# Altium project Emergency_Isolator.PrjPCB
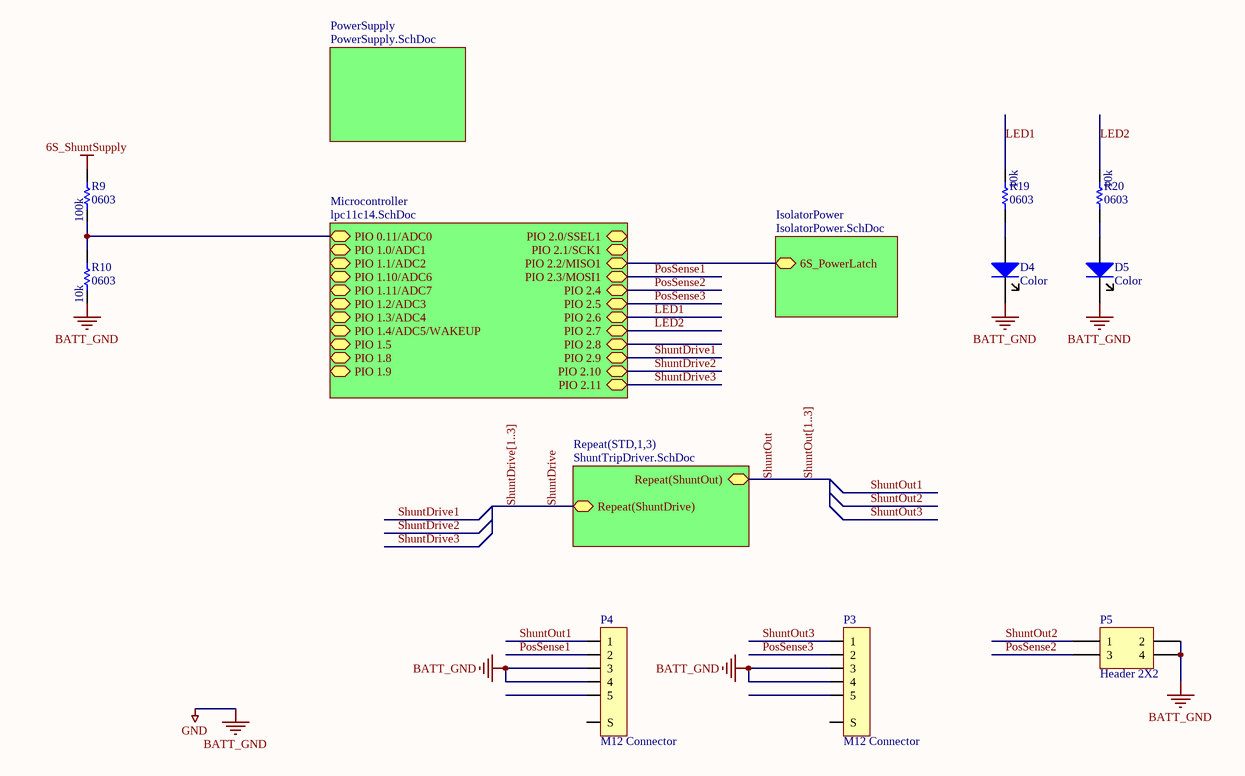
[diagram p0: IsolatorTop.SchDoc]
5 sheets, 75 parts. Net scope: hierarchical (ports join the sheet entries above them; power ports are global).
Board file: EmergencyIsolator.PcbDoc
Sheets:
  IsolatorTop.SchDoc
    IsolatorPower = IsolatorPower.SchDoc
    STD1 = ShuntTripDriver.SchDoc
    STD2 = ShuntTripDriver.SchDoc
    STD3 = ShuntTripDriver.SchDoc
    Microcontroller = lpc11c14.SchDoc
    PowerSupply = PowerSupply.SchDoc

## Sheet IsolatorTop.SchDoc
size A4

### Parts
D4  value Color  [CAP_0.1_POL]  (hidden comment: LED)
D5  value Color  [CAP_0.1_POL]  (hidden comment: LED)
P3  M12 Connector  [M12_5P_VERT]
P4  M12 Connector  [M12_5P_VERT]
P5  Header 2X2  [HDR2X2]
R9  value 100k  package: 0603  [0603_M]  (hidden comment: R)
R10  value 10k  package: 0603  [0603_M]  (hidden comment: R)
R19  value 10k  package: 0603  [0603_M]  (hidden comment: R)
R20  value 10k  package: 0603  [0603_M]  (hidden comment: R)

### Sub-sheets
IsolatorPower = IsolatorPower.SchDoc: 6S_PowerLatch
Microcontroller = lpc11c14.SchDoc: PIO 1.0/ADC1, PIO 1.1/ADC2, PIO 1.10/ADC6, PIO 1.11/ADC7, PIO 1.2/ADC3, PIO 1.3/ADC4, PIO 1.4/ADC5/WAKEUP, PIO 1.5, PIO 1.8, PIO 1.9, PIO 0.11/ADC0, PIO 2.6, PIO 2.0/SSEL1, PIO 2.7, PIO 2.3/MOSI1, PIO 2.8, PIO 2.1/SCK1, PIO 2.4, PIO 2.11, PIO 2.5, PIO 2.2/MISO1, PIO 2.9, PIO 2.10
PowerSupply = PowerSupply.SchDoc: no entries
Repeat(STD,1,3) = ShuntTripDriver.SchDoc: Repeat(ShuntOut), Repeat(ShuntDrive)

### Nets
6S_ShuntSupply: R9.1
BATT_GND: D4.2(K) D5.2(K) P3.3 P3.4 P4.3 P4.4 P5.2 P5.4 R10.2  [also labelled GND]
6S_PowerLatch: sheet IsolatorPower/6S_PowerLatch, sheet Microcontroller/PIO 2.2/MISO1
LED1: R19.2 ; sheet Microcontroller/PIO 2.6
LED2: R20.2 ; sheet Microcontroller/PIO 2.7
PIO 0.11/ADC0: R9.2 R10.1 ; sheet Microcontroller/PIO 0.11/ADC0
PosSense1: P4.2 ; sheet Microcontroller/PIO 2.3/MOSI1  [project net PIO 2.3/MOSI1]
PosSense2: P5.3 ; sheet Microcontroller/PIO 2.4  [project net PIO 2.4]
PosSense3: P3.2 ; sheet Microcontroller/PIO 2.5  [project net PIO 2.5]
ShuntDrive: sheet Repeat(STD,1,3)/Repeat(ShuntDrive)
ShuntOut: sheet Repeat(STD,1,3)/Repeat(ShuntOut)
ShuntOut1: P4.1
ShuntOut2: P5.1
ShuntOut3: P3.1
NetD4_1: D4.1(A) R19.1
NetD5_1: D5.1(A) R20.1

Not connected (* = marked no-connect by the designer): P3 5 S; P4 5 S

### Buses and harness runs
bus ShuntDrive[1..3]
bus ShuntOut[1..3]

### Library data of the parts
D4 D5 = D LED: Supplier 1: Digi-Key
P3 P4 = M12 Connector: 5 Pin
P5 = Header 2X2: Header, 2-Pin, Dual row; LatestRevisionDate: 17-Jul-2002; LatestRevisionNote: Re-released for DXP Platform.; Publisher: Altium Limited
R9 R10 R19 R20 = R: Resistor; Supplier 1: Digikey

## Sheet IsolatorPower.SchDoc
size A4
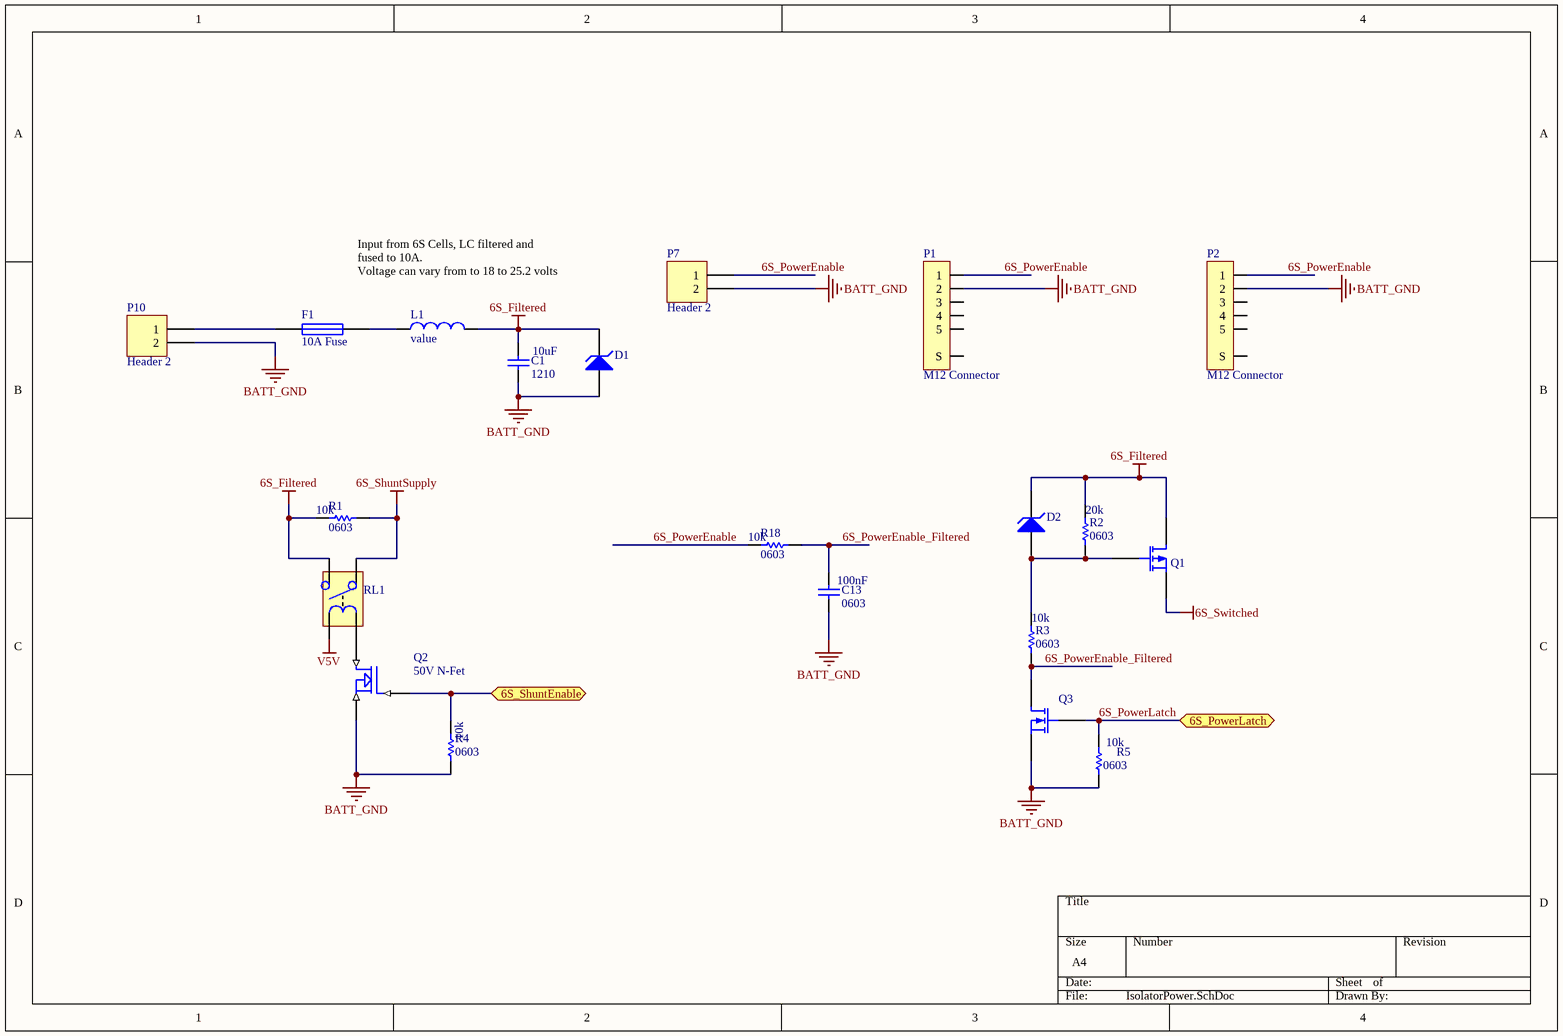
[diagram p1: IsolatorPower.SchDoc]

### Parts
C1  value 10uF  package: 1210  [1210_M]  (hidden comment: C)
C13  value 100nF  package: 0603  [0603_M]  (hidden comment: C)
D1  (no value)  [0805_M_POL]
D2  (no value)  [0805_M_POL]
F1  10A Fuse  [LITTELFUSE-154]
L1  value  [0805_M]
P1  M12 Connector  [M12_5P_VERT]
P2  M12 Connector  [M12_5P_VERT]
P7  Header 2  [HDR1X2]
P10  Header 2  [HDR1X2]
Q1  PFET 40V 10A  [TO-252 (D-Pak)]  (value not drawn)
Q2  50V N-Fet  [SOT23-3]
Q3  NFET 30V 5A  [SOT23-3]  (value not drawn)
R1  value 10k  package: 0603  [0603_M]  (hidden comment: R)
R2  value 20k  package: 0603  [0603_M]  (hidden comment: R)
R3  value 10k  package: 0603  [0603_M]  (hidden comment: R)
R4  value 10k  package: 0603  [0603_M]  (hidden comment: R)
R5  value 10k  package: 0603  [0603_M]  (hidden comment: R)
R18  value 10k  package: 0603  [0603_M]  (hidden comment: R)
RL1  Relay  [RELAY_G5Q_4PIN]  (value not drawn)

### Ports
6S_PowerLatch, 6S_ShuntEnable

### Nets
6S_Filtered: C1.1 D1.2(K) D2.2(K) L1.2(B) Q1.1(D) R1.2 R2.2 RL1.2
6S_ShuntSupply: R1.1 RL1.3
6S_Switched: Q1.3(S)
BATT_GND: C1.2 C13.2 D1.1(A) P1.2 P2.2 P7.2 P10.2 Q2.2(S) Q3.2(S) R4.1 R5.1
V5V: RL1.1
6S_PowerEnable: P1.1 P2.1 P7.1 R18.2
6S_PowerEnable_Filtered: C13.1 Q3.3(D) R3.1 R18.1
6S_PowerLatch: Q3.1(G) R5.2 ; port 6S_PowerLatch
NetD2_1: D2.1(A) Q1.2(G) R2.1 R3.2
NetF1_1: F1.1 P10.1
NetF1_2: F1.2 L1.1(A)
NetQ2_1: Q2.1(G) R4.2 ; port 6S_ShuntEnable
NetQ2_3: Q2.3(D) RL1.5

Not connected (* = marked no-connect by the designer): P1 3 4 5 S; P2 3 4 5 S

### Notes on the sheet
- Input from 6S Cells, LC filtered and fused to 10A.
  Voltage can vary from to 18 to 25.2 volts

### Library data of the parts
C1 C13 = C: Default Capacitor; Supplier: Digikey
D1 D2 = D Zener: Zener Diode; Supplier 1: Digikey
F1 = FUSE
L1 = L: Inductor
P1 P2 = M12 Connector: 5 Pin
P7 P10 = Header 2: Header, 2-Pin; LatestRevisionDate: 17-Jul-2002; LatestRevisionNote: Re-released for DXP Platform.; Publisher: Altium Limited
Q1 = PFET 40V 10A: 10A 40V; Supplier 1: Digi-Key; Supplier Part Number 1: 497-2456-1-ND
Q2 = ZXM61N02F: 1.7A, 20V N-Channel Enhancement mode FET
R1-R5 R18 = R: Resistor; Supplier 1: Digikey
RL1 = Relay: 10A 30VDC Max Normally Open; Manufacturer: Omron Electronics Inc-EMC Div; Manufacturer Part Number: G5Q-1A4 DC5; Description: RELAY GEN PURPOSE SPST 10A 5V; Relay Type: General Purpose; Coil Type: Non Latching; Coil Current: 40mA; Coil Voltage: 5VDC; Contact Form: SPST-NO (1 Form A); Switching Voltage: 277VAC, 30VDC - Max; Turn On Voltage (Max): 3.75 VDC; Turn Off Voltage (Min): 0.25 VDC; Operate Time: 10ms; Release Time: 5ms; Coil Power: 200 mW; Coil Resistance: 125 Ohms; Supplier 1: Digi-Key; RoHS: RoHS Compliant; Category: Relays; Stock 1: 6697; Pricing 1: 1=3.69, 10=3.459, 25=3.0752, 50=2.9214, 100=2.7676, 250=2.46012, 500=2.30634, 1000=2.15258, 2500=2.11414 (AUD); Packaging: Bulk; Contact Rating (Current): 10A; Features: Insulation - Class F, Sealed - Fully; Mounting Type: Through Hole; Termination Style: PC Pin; Contact Material: Silver Alloy; Operating Temperature: -40°C ~ 105°C; ComponentLink1URL: http://components.omron.com/components/web/PDFLIB.nsf/0/390BE1B2058B30BF85257201007DD57C/$file/G5Q_0911.pdf; ComponentLink1Description: http://components.omron.com/components/web/PDFLIB.nsf/0/390BE1B2058B30BF85257201007DD57C/$file/G5Q_0911.pdf; Supplier Part Number 1: Z3632-ND
Q3 = NFET 30V 5A: Supplier 1: Digi-Key; Supplier Part Number 1: IRLML6344TRPBFCT-ND

## Sheet ShuntTripDriver.SchDoc
size A4
Used 3 times, as channels STD1, STD2, STD3. Parts and nets are listed once, with the designators drawn on the sheet.
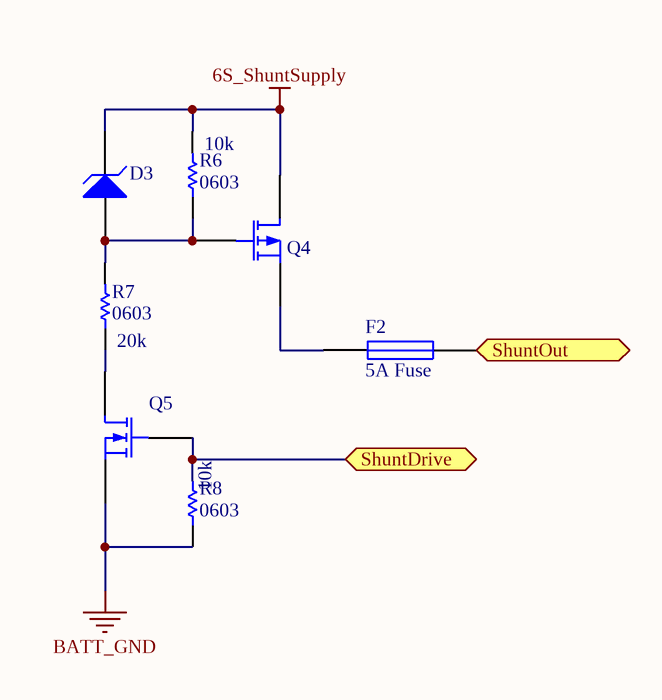
[diagram p2: ShuntTripDriver.SchDoc]

### Parts
D3  (no value)  [0805_M_POL]
F2  5A Fuse  [LITTELFUSE-154]
Q4  PFET 40V 10A  [TO-252 (D-Pak)]  (value not drawn)
Q5  NFET 30V 5A  [SOT23-3]  (value not drawn)
R6  value 10k  package: 0603  [0603_M]  (hidden comment: R)
R7  value 20k  package: 0603  [0603_M]  (hidden comment: R)
R8  value 10k  package: 0603  [0603_M]  (hidden comment: R)

### Ports
ShuntDrive, ShuntOut

### Nets
6S_ShuntSupply: D3.2(K) Q4.1(D) R6.2
BATT_GND: Q5.2(S) R8.1
ShuntDrive: Q5.1(G) R8.2 ; port ShuntDrive
ShuntOut: F2.2 ; port ShuntOut
NetD3_1: D3.1(A) Q4.2(G) R6.1 R7.2
NetF2_1: F2.1 Q4.3(S)
NetQ5_3: Q5.3(D) R7.1

### Channels
STD1: designators end in _STD1; ports ShuntDrive=PIO 2.9 ShuntOut=ShuntOut1
STD2: designators end in _STD2; ports ShuntDrive=PIO 2.10 ShuntOut=ShuntOut2
STD3: designators end in _STD3; ports ShuntDrive=PIO 2.11 ShuntOut=ShuntOut3

### Library data of the parts
D3 = D Zener: Zener Diode; Supplier 1: Digikey
F2 = FUSE
Q4 = PFET 40V 10A: 10A 40V; Supplier 1: Digi-Key; Supplier Part Number 1: 497-2456-1-ND
R6-R8 = R: Resistor; Supplier 1: Digikey
Q5 = NFET 30V 5A: Supplier 1: Digi-Key; Supplier Part Number 1: IRLML6344TRPBFCT-ND

## Sheet lpc11c14.SchDoc
size A4; Organization: UNSW Solar Racing Team; Address3: UNSW; Address4: Sydney NSW 2052; Address2: Electrical Engineering; Address1: Rm 109
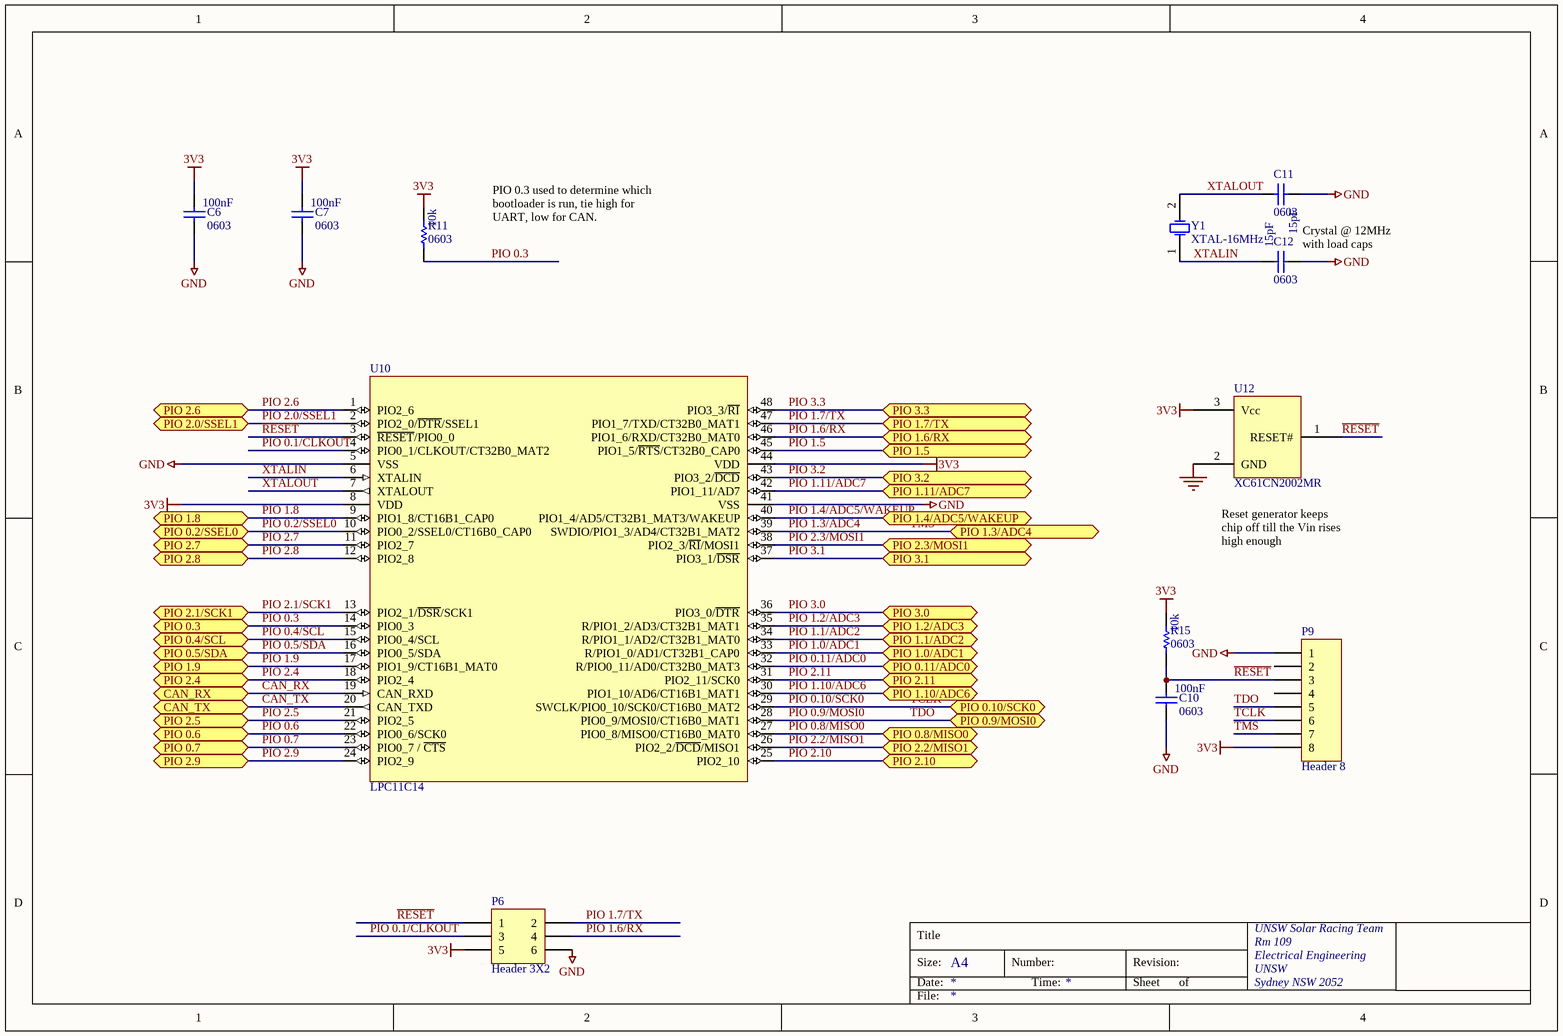
[diagram p3: lpc11c14.SchDoc]

### Parts
C6  value 100nF  package: 0603  [0603_M]  (hidden comment: C)
C7  value 100nF  package: 0603  [0603_M]  (hidden comment: C)
C10  value 100nF  package: 0603  [0603_M]  (hidden comment: C)
C11  value 15pF  package: 0603  [0603_M]  (hidden comment: C)
C12  value 15pF  package: 0603  [0603_M]  (hidden comment: C)
P6  Header 3X2  [HDR2X3]
P9  Header 8  [HDR1X8]
R11  value 10k  package: 0603  [0603_M]  (hidden comment: R)
R15  value 10k  package: 0603  [0603_M]  (hidden comment: R)
U10  LPC11C14  [QFP48]
U12  XC61CN2002MR  [SOT23-3]
Y1  XTAL-16MHz  [XTAL_TH_4.88MM]

### Ports
CAN_RX, CAN_TX, PIO 0.2/SSEL0, PIO 0.3, PIO 0.4/SCL, PIO 0.5/SDA, PIO 0.6, PIO 0.7, PIO 0.8/MISO0, PIO 0.9/MOSI0, PIO 0.10/SCK0, PIO 0.11/ADC0, PIO 1.0/ADC1, PIO 1.1/ADC2, PIO 1.2/ADC3, PIO 1.3/ADC4, PIO 1.4/ADC5/WAKEUP, PIO 1.5, PIO 1.6/RX, PIO 1.7/TX, PIO 1.8, PIO 1.9, PIO 1.10/ADC6, PIO 1.11/ADC7, PIO 2.0/SSEL1, PIO 2.1/SCK1, PIO 2.2/MISO1, PIO 2.3/MOSI1, PIO 2.4, PIO 2.5, PIO 2.6, PIO 2.7, PIO 2.8, PIO 2.9, PIO 2.10, PIO 2.11, PIO 3.0, PIO 3.1, PIO 3.2, PIO 3.3

### Nets
3V3: C6.1 C7.1 P6.5 P9.8 R11.2 R15.2 U10.8(VDD) U10.44(VDD) U12.3(Vcc)
GND: C6.2 C7.2 C10.2 C11.1 C12.2 P6.6 P9.1 U10.5(VSS) U10.41(VSS) U12.2(GND)  [project net BATT_GND]
CAN_RX: U10.19(CAN_RXD) ; port CAN_RX
CAN_TX: U10.20(CAN_TXD) ; port CAN_TX
PIO 0.1/CLKOUT: P6.3 U10.4(PIO0_1/CLKOUT/CT32B0_MAT2)
PIO 0.2/SSEL0: U10.10(PIO0_2/SSEL0/CT16B0_CAP0) ; port PIO 0.2/SSEL0
PIO 0.3: R11.1 U10.14(PIO0_3) ; port PIO 0.3
PIO 0.4/SCL: U10.15(PIO0_4/SCL) ; port PIO 0.4/SCL
PIO 0.5/SDA: U10.16(PIO0_5/SDA) ; port PIO 0.5/SDA
PIO 0.6: U10.22(PIO0_6/SCK0) ; port PIO 0.6
PIO 0.7: U10.23(PIO0_7_/_~{CTS}) ; port PIO 0.7
PIO 0.8/MISO0: U10.27(PIO0_8/MISO0/CT16B0_MAT0) ; port PIO 0.8/MISO0
PIO 0.9/MOSI0: P9.5 U10.28(PIO0_9/MOSI0/CT16B0_MAT1) ; port PIO 0.9/MOSI0  [also labelled TDO]
PIO 0.10/SCK0: P9.6 U10.29(SWCLK/PIO0_10/SCK0/CT16B0_MAT2) ; port PIO 0.10/SCK0  [also labelled TCLK]
PIO 0.11/ADC0: U10.32(R/PIO0_11/AD0/CT32B0_MAT3) ; port PIO 0.11/ADC0
PIO 1.0/ADC1: U10.33(R/PIO1_0/AD1/CT32B1_CAP0) ; port PIO 1.0/ADC1
PIO 1.1/ADC2: U10.34(R/PIO1_1/AD2/CT32B1_MAT0) ; port PIO 1.1/ADC2
PIO 1.2/ADC3: U10.35(R/PIO1_2/AD3/CT32B1_MAT1) ; port PIO 1.2/ADC3
PIO 1.3/ADC4: P9.7 U10.39(SWDIO/PIO1_3/AD4/CT32B1_MAT2) ; port PIO 1.3/ADC4  [also labelled TMS]
PIO 1.4/ADC5/WAKEUP: U10.40(PIO1_4/AD5/CT32B1_MAT3/WAKEUP) ; port PIO 1.4/ADC5/WAKEUP
PIO 1.5: U10.45(PIO1_5/~{RTS}/CT32B0_CAP0) ; port PIO 1.5
PIO 1.6/RX: P6.4 U10.46(PIO1_6/RXD/CT32B0_MAT0) ; port PIO 1.6/RX
PIO 1.7/TX: P6.2 U10.47(PIO1_7/TXD/CT32B0_MAT1) ; port PIO 1.7/TX
PIO 1.8: U10.9(PIO1_8/CT16B1_CAP0) ; port PIO 1.8
PIO 1.9: U10.17(PIO1_9/CT16B1_MAT0) ; port PIO 1.9
PIO 1.10/ADC6: U10.30(PIO1_10/AD6/CT16B1_MAT1) ; port PIO 1.10/ADC6
PIO 1.11/ADC7: U10.42(PIO1_11/AD7) ; port PIO 1.11/ADC7
PIO 2.0/SSEL1: U10.2(PIO2_0/~{DTR}/SSEL1) ; port PIO 2.0/SSEL1
PIO 2.1/SCK1: U10.13(PIO2_1/~{DSR}/SCK1) ; port PIO 2.1/SCK1
PIO 2.2/MISO1: U10.26(PIO2_2/~{DCD}/MISO1) ; port PIO 2.2/MISO1  [project net 6S_PowerLatch]
PIO 2.3/MOSI1: U10.38(PIO2_3/~{RI}/MOSI1) ; port PIO 2.3/MOSI1
PIO 2.4: U10.18(PIO2_4) ; port PIO 2.4
PIO 2.5: U10.21(PIO2_5) ; port PIO 2.5
PIO 2.6: U10.1(PIO2_6) ; port PIO 2.6  [project net LED1]
PIO 2.7: U10.11(PIO2_7) ; port PIO 2.7  [project net LED2]
PIO 2.8: U10.12(PIO2_8) ; port PIO 2.8
PIO 2.9: U10.24(PIO2_9) ; port PIO 2.9
PIO 2.10: U10.25(PIO2_10) ; port PIO 2.10
PIO 2.11: U10.31(PIO2_11/SCK0) ; port PIO 2.11
PIO 3.0: U10.36(PIO3_0/~{DTR}) ; port PIO 3.0
PIO 3.1: U10.37(PIO3_1/~{DSR}) ; port PIO 3.1
PIO 3.2: U10.43(PIO3_2/~{DCD}) ; port PIO 3.2
PIO 3.3: U10.48(PIO3_3/~{RI}) ; port PIO 3.3
~{RESET}: C10.1 P6.1 P9.3 R15.1 U10.3(~{RESET}/PIO0_0) U12.1(RESET#)
XTALIN: C12.1 U10.6(XTALIN) Y1.1(OSC1)
XTALOUT: C11.2 U10.7(XTALOUT) Y1.2(OSC2)

Not connected (* = marked no-connect by the designer): P9 2 4

### Notes on the sheet
- PIO 0.3 used to determine which bootloader is run, tie high for UART, low for CAN.
- Crystal @ 12MHz with load caps
- (near U12) Reset generator keeps chip off till the Vin rises high enough
- Text
- Title
- Size:
- Date:
- A4
- Number:
- Time:
- Revision:
- Sheet
- of
- File:

### Library data of the parts
C6 C7 C10-C12 = C: Default Capacitor; Supplier: Digikey
P6 = Header 3X2: Header, 3-Pin, Dual row; LatestRevisionDate: 17-Jul-2002; LatestRevisionNote: Re-released for DXP Platform.; Publisher: Altium Limited
P9 = Header 8: Header, 8-Pin; LatestRevisionDate: 17-Jul-2002; LatestRevisionNote: Re-released for DXP Platform.; Publisher: Altium Limited
R11 R15 = R: Resistor; Supplier 1: Digikey
U10 = LPC11C14_Full: NXP LPC11C14 Microcontroller; Farnell: NA
U12 = XC61F: SOT23 reset generator; Needed?: Farnell; Farnell: 3605486; Farnell Price: 1.74
Y1 = XTAL-16MHz: Crystal Oscillator; Manufacturer: NDK; Manufacturer Part Number: NX5032GA-16.000000MHZ-LN-CD-1; Frequency: 16MHz; Frequency Stability: ±50ppm; Load Capacitance: 8pF; ESR (Equivalent Series Resistance): 120 Ohm; Operating Mode: Fundamental; Published: 8-Jun-2000; LatestRevisionDate: 17-Jul-2002; LatestRevisionNote: Re-released for DXP Platform.; PackageReference: R38; Publisher: Altium Limited; PackageDescription: Crystal, Thru-Hole; 2 Leads; Body 3.1 x 8.2 mm (Dia.xH); Supplier 1: Digi-Key; RoHS: RoHS Compliant; Category: Crystals and Oscillators; Stock 1: 27087; Pricing 1: 1=0.81, 10=0.702, 50=0.6156, 100=0.486, 500=0.4104 (USD); Type: MHz Crystal; Frequency Tolerance: ±50ppm; Operating Temperature: -10°C ~ 70°C; Ratings: -; Mounting Type: Surface Mount; Package / Case: 2-SMD; Size / Dimension: 0.197" L x 0.126" W (5.00mm x 3.20mm); Height: 0.059" (1.50mm); Packaging: Cut Tape (CT); ComponentLink1URL: http://media.digikey.com/pdf/Data%20Sheets/NDK%20PDFs/NX5032GA.pdf; ComponentLink1Description: http://media.digikey.com/pdf/Data%20Sheets/NDK%20PDFs/NX5032GA.pdf; Supplier Part Number 1: 644-1037-1-ND

## Sheet PowerSupply.SchDoc
size A4
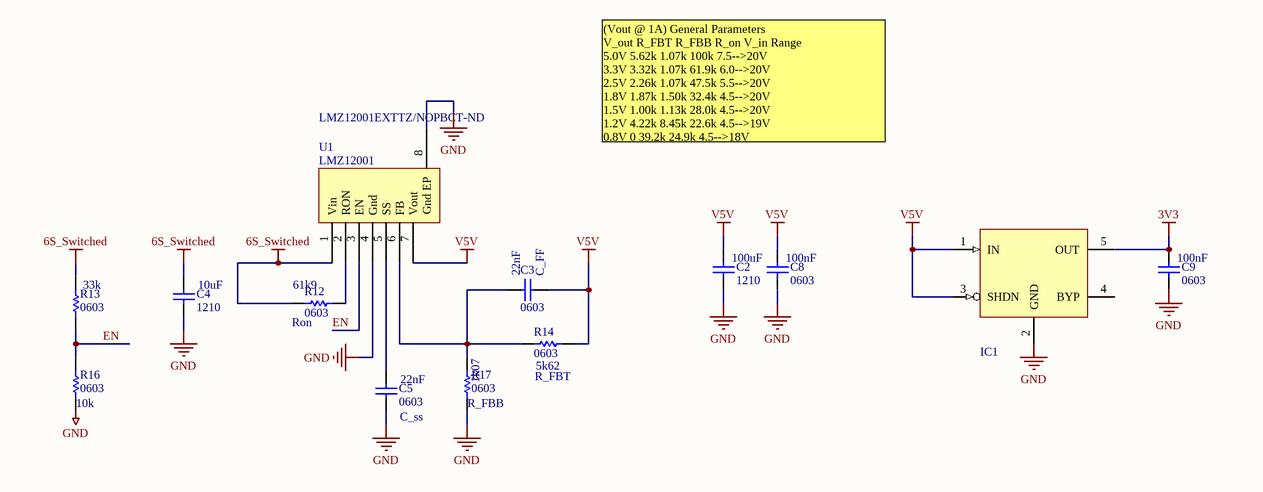
[diagram p4: PowerSupply.SchDoc]

### Parts
C2  value 100uF  package: 1210  [1210_M]  (hidden comment: C)
C3  value 22nF  package: 0603  [0603_M]  (hidden comment: C)
C4  value 10uF  package: 1210  [1210_M]  (hidden comment: C)
C5  value 22nF  package: 0603  [0603_M]  (hidden comment: C)
C8  value 100nF  package: 0603  [0603_M]  (hidden comment: C)
C9  value 100nF  package: 0603  [0603_M]  (hidden comment: C)
IC1  3.3V Regulator  [SOT23-5]  (value not drawn)
R12  value 61k9  package: 0603  [0603_M]  (hidden comment: R)
R13  value 33k  package: 0603  [0603_M]  (hidden comment: R)
R14  value 5k62  package: 0603  [0603_M]  (hidden comment: R)
R16  value 10k  package: 0603  [0603_M]  (hidden comment: R)
R17  value 1k07  package: 0603  [0603_M]  (hidden comment: R)
U1  LMZ12001  Supplier Part Number 1: LMZ12001EXTTZ/NOPBCT-ND  [LMZ12001]

### Nets
3V3: C9.1 IC1.5(OUT)
6S_Switched: C4.1 R12.2 R13.2 U1.1(Vin)
GND: C2.2 C4.2 C5.2 C8.2 C9.2 IC1.2(GND) R16.1 R17.1 U1.4(Gnd) U1.8(Gnd_EP)  [project net BATT_GND]
V5V: C2.1 C3.2 C8.1 IC1.1(IN) IC1.3(SHDN) R14.2 U1.7(Vout)
EN: R13.1 R16.2 U1.3(EN)
NetC3_1: C3.1 R14.1 R17.2 U1.6(FB)
NetC5_1: C5.1 U1.5(SS)
NetR12_1: R12.1 U1.2(RON)

Not connected (* = marked no-connect by the designer): IC1 4(BYP)

### Notes on the sheet
- (Vout @ 1A) General Parameters
  V_out	R_FBT	R_FBB	R_on	V_in Range
  5.0V	5.62k	1.07k	100k	7.5-->20V
  3.3V	3.32k	1.07k	61.9k	6.0-->20V
  2.5V	2.26k	1.07k	47.5k	5.5-->20V
  1.8V	1.87k	1.50k	32.4k	4.5-->20V
  1.5V	1.00k	1.13k	28.0k	4.5-->20V
  1.2V	4.22k	8.45k	22.6k	4.5-->19V
  0.8V	0	39.2k	24.9k	4.5-->18V
- (near C3) C_FF
- (near R12) Ron
- (near C5) C_ss
- (near R17) R_FBB
- (near R14) R_FBT

### Library data of the parts
C2-C5 C8 C9 = C: Default Capacitor; Supplier: Digikey
IC1 = MIC5259-3.3: Manufacturer: Micrel Inc; Manufacturer Part Number: MIC5259-3.3YD5 TR; Regulator Topology: Positive Fixed; Voltage - Input: Up to 6V; Voltage - Dropout (Typical): 0.3V @ 300mA; Number of Regulators: 1; Current - Output: 300mA; Current - Limit (Min): 350mA; Supplier 1: Digi-Key; RoHS: RoHS Compliant; Category: Integrated Circuits (ICs); Stock 1: 10613; Pricing 1: 1=1.23, 25=0.98, 100=0.735, 250=0.686, 500=0.6615 (USD); Voltage - Output: 3.3V; Operating Temperature: -40°C ~ 125°C; Mounting Type: Surface Mount; Package / Case: SOT-23-5 Thin, TSOT-23-5; Supplier Device Package: TSOT-23-5; Packaging: Cut Tape (CT); ComponentLink1URL: http://www.micrel.com/_PDF/mic5259.pdf; ComponentLink1Description: http://www.micrel.com/_PDF/mic5259.pdf; Supplier Part Number 1: 576-2833-1-ND
R12-R14 R16 R17 = R: Resistor; Supplier 1: Digikey
U1 = LMZ12001: Switching Regulator; Supplier 1: Digi-Key

## Nets that join several sheets
3V3: lpc11c14 (9 pins), PowerSupply (C9.1 IC1.5)
6S_ShuntSupply: IsolatorTop (R9.1), IsolatorPower (R1.1 RL1.3), STD1 (D3_STD1.2 Q4_STD1.1 R6_STD1.2), STD2 (D3_STD2.2 Q4_STD2.1 R6_STD2.2), STD3 (D3_STD3.2 Q4_STD3.1 R6_STD3.2)
6S_Switched: IsolatorPower (Q1.3), PowerSupply (C4.1 R12.2 R13.2 U1.1)
BATT_GND: IsolatorTop (9 pins), IsolatorPower (11 pins), STD1 (Q5_STD1.2 R8_STD1.1), STD2 (Q5_STD2.2 R8_STD2.1), STD3 (Q5_STD3.2 R8_STD3.1), lpc11c14 (10 pins), PowerSupply (10 pins)
V5V: IsolatorPower (RL1.1), PowerSupply (7 pins)
6S_PowerLatch: IsolatorPower (Q3.1 R5.2), lpc11c14 (U10.26)
LED1: IsolatorTop (R19.2), lpc11c14 (U10.1)
LED2: IsolatorTop (R20.2), lpc11c14 (U10.11)
PIO 0.11/ADC0: IsolatorTop (R9.2 R10.1), lpc11c14 (U10.32)
PIO 2.3/MOSI1: IsolatorTop (P4.2), lpc11c14 (U10.38)
PIO 2.4: IsolatorTop (P5.3), lpc11c14 (U10.18)
PIO 2.5: IsolatorTop (P3.2), lpc11c14 (U10.21)
PIO 2.9: STD1 (Q5_STD1.1 R8_STD1.2), lpc11c14 (U10.24)
PIO 2.10: STD2 (Q5_STD2.1 R8_STD2.2), lpc11c14 (U10.25)
PIO 2.11: STD3 (Q5_STD3.1 R8_STD3.2), lpc11c14 (U10.31)
ShuntOut1: IsolatorTop (P4.1), STD1 (F2_STD1.2)
ShuntOut2: IsolatorTop (P5.1), STD2 (F2_STD2.2)
ShuntOut3: IsolatorTop (P3.1), STD3 (F2_STD3.2)